# Altium schematic sheet Sheet2.SchDoc
size A4
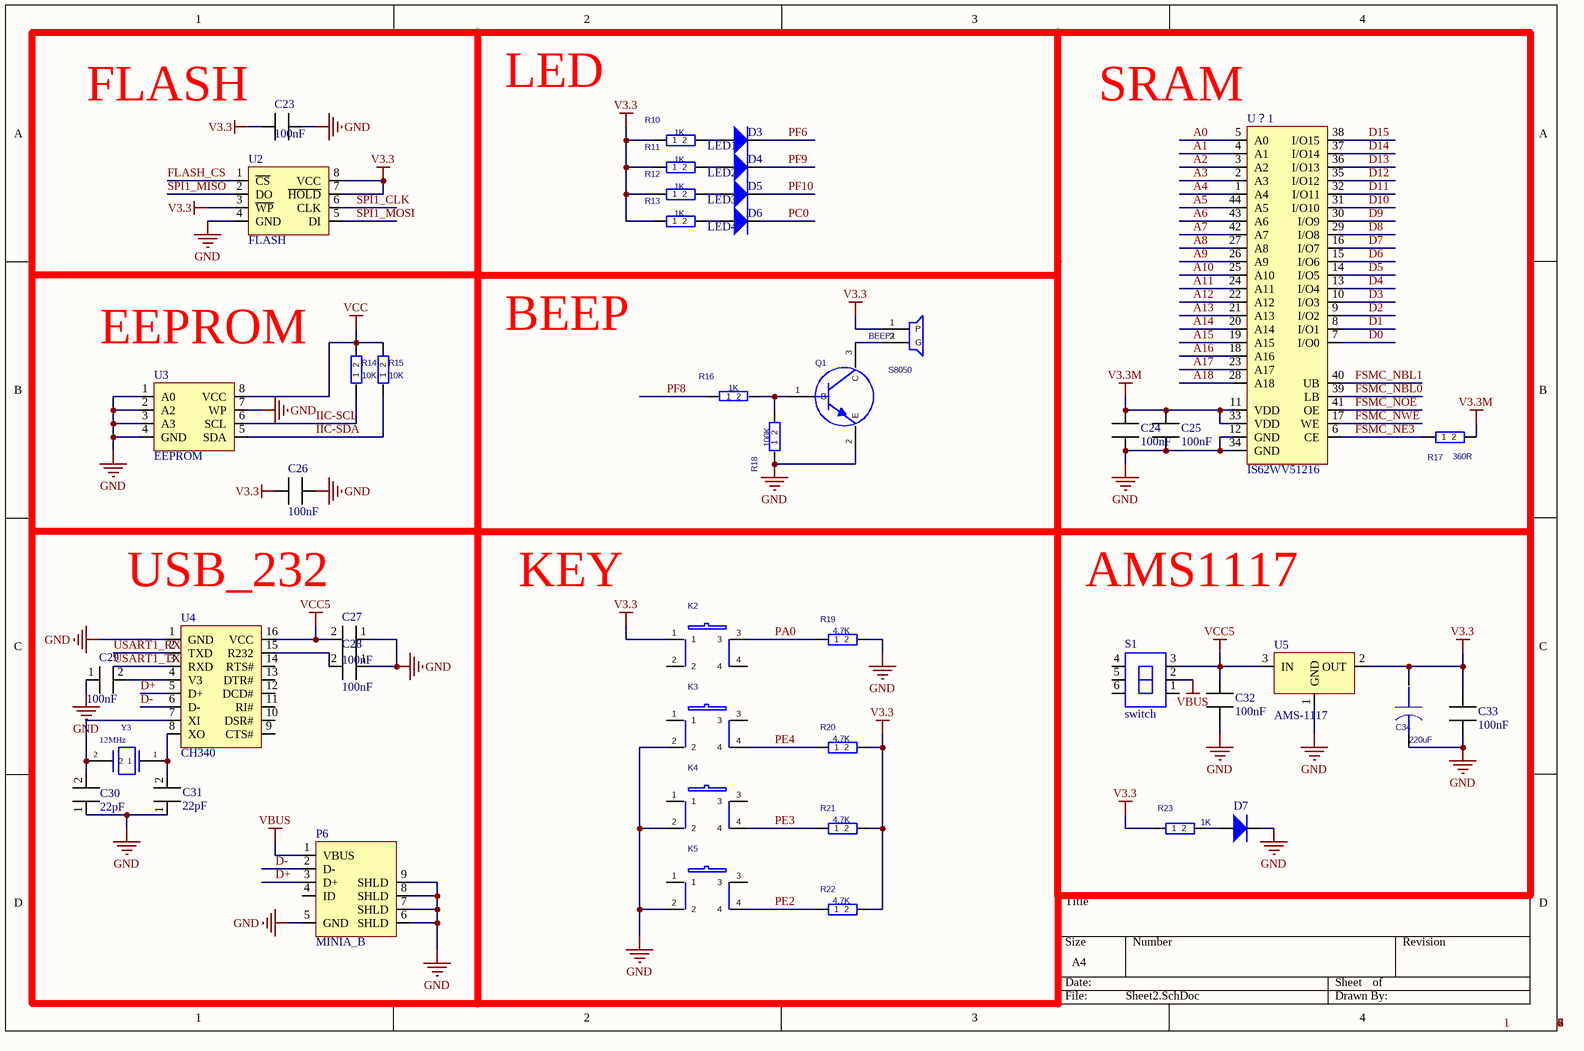
[diagram p0: Sheet2.SchDoc]

## Parts
BEEP1  BEEP-9.5X5.5  [BEEP-9.5X5.5]  (value not drawn)
C23  100nF  [CAP_0603_FIRE]
C24  100nF  [CAP_0603_FIRE]
C25  100nF  [CAP_0603_FIRE]
C26  100nF  [CAP_0603_FIRE]
C27  100nF  [CAP_0603_FIRE]
C28  100nF  [CAP_0603_FIRE]
C29  100nF  [CAP_0603_FIRE]
C30  22pF  [CAP_0603_FIRE]
C31  22pF  [CAP_0603_FIRE]
C32  100nF  [CAP_0603_FIRE]
C33  100nF  [CAP_0603_FIRE]
C34  value 220uF  [CAP+_47UF_FIRE]  (hidden comment: CAP+_47UF_FIRE)
D3  LED1  [DIODE_SOP]
D4  LED2  [DIODE_SOP]
D5  LED3  [DIODE_SOP]
D6  LED4  [DIODE_SOP]
D7  (no value)  [DIODE_SOP]
K2  KEY  [SW6.2/6.2-SMD]  (value not drawn)
K3  KEY  [SW6.2/6.2-SMD]  (value not drawn)
K4  KEY  [SW6.2/6.2-SMD]  (value not drawn)
K5  KEY  [SW6.2/6.2-SMD]  (value not drawn)
P6  MINIA_B  [USB-MINI]
Q1  S8050  [SOT-23]
R10  value 1K  [RES_0603_FIRE]  (hidden comment: RES_1K_0603_FIRE)
R11  value 1K  [RES_0603_FIRE]  (hidden comment: RES_1K_0603_FIRE)
R12  value 1K  [RES_0603_FIRE]  (hidden comment: RES_1K_0603_FIRE)
R13  value 1K  [RES_0603_FIRE]  (hidden comment: RES_1K_0603_FIRE)
R14  value 10K  [RES_0603_FIRE]  (hidden comment: RES_10K_0603_FIRE)
R15  value 10K  [RES_0603_FIRE]  (hidden comment: RES_10K_0603_FIRE)
R16  value 1K  [RES_0603_FIRE]  (hidden comment: RES_100R_0603_FIRE)
R17  value 360R  [RES_0603_FIRE]  (hidden comment: RES_1K_0603_FIRE)
R18  value 100K  [RES_0603_FIRE]  (hidden comment: RES_1K_0603_FIRE)
R19  value 4.7K  [RES_0603_FIRE]  (hidden comment: RES_4K7_0603_FIRE)
R20  value 4.7K  [RES_0603_FIRE]  (hidden comment: RES_4K7_0603_FIRE)
R21  value 4.7K  [RES_0603_FIRE]  (hidden comment: RES_4K7_0603_FIRE)
R22  value 4.7K  [RES_0603_FIRE]  (hidden comment: RES_4K7_0603_FIRE)
R23  value 1K  [RES_0603_FIRE]  (hidden comment: RES_1K_0603_FIRE)
S1  switch  [switch]
U2  FLASH  [SOP8A]
U3  EEPROM  [SOP8]
U4  CH340  [SOP16]
U5  AMS-1117  [AMS-1117-3.3]
U？1  IS62WV51216  [IS62WV51216]
Y3  value 12MHz  [XTAL_SMD]  (hidden comment: XTAL_12M)

## Nets
GND: C23.1 C24.1 C25.1 C26.1 C27.1 C28.1 C29.1 C30.1 C31.1 C32.1 C33.1 C34.2 D7.2 K3.2 K4.2 K5.2 P6.5(GND) P6.6(SHLD) P6.7(SHLD) P6.8(SHLD) P6.9(SHLD) Q1.2(E) R18.1 R19.2 U2.4(GND) U3.1(A0) U3.2(A2) U3.3(A3) U3.4(GND) U3.7(WP) U4.1(GND) U5.1(GND) U？1.12(GND) U？1.34(GND)
V3.3: BEEP1.1(P) C23.2 C26.2 C33.2 C34.1 K2.1 R10.1 R11.1 R12.1 R13.1 R20.2 R21.2 R22.2 R23.1 U2.3(~{WP}) U2.7(~{HOLD}) U2.8(VCC) U5.2(OUT)
V3.3M: C24.2 C25.2 R17.2 U？1.11(VDD) U？1.33(VDD)
VBUS: P6.1(VBUS) S1.2
VCC: R14.2 R15.2 U3.8(VCC)
VCC5: C27.2 C32.2 S1.3 U4.16(VCC) U5.3(IN)
A0: U？1.5(A0)
A1: U？1.4(A1)
A2: U？1.3(A2)
A3: U？1.2(A3)
A4: U？1.1(A4)
A5: U？1.44(A5)
A6: U？1.43(A6)
A7: U？1.42(A7)
A8: U？1.27(A8)
A9: U？1.26(A9)
A10: U？1.25(A10)
A11: U？1.24(A11)
A12: U？1.22(A12)
A13: U？1.21(A13)
A14: U？1.20(A14)
A15: U？1.19(A15)
A16: U？1.18(A16)
A17: U？1.23(A17)
A18: U？1.28(A18)
D0: U？1.7(I/O0)
D1: U？1.8(I/O1)
D2: U？1.9(I/O2)
D3: U？1.10(I/O3)
D4: U？1.13(I/O4)
D5: U？1.14(I/O5)
D6: U？1.15(I/O6)
D7: U？1.16(I/O7)
D8: U？1.29(I/O8)
D9: U？1.30(I/O9)
D10: U？1.31(I/O10)
D11: U？1.32(I/O11)
D12: U？1.35(I/O12)
D13: U？1.36(I/O13)
D14: U？1.37(I/O14)
D15: U？1.38(I/O15)
D+: P6.3(D+) U4.5(D+)
D-: P6.2(D-) U4.6(D-)
FLASH_CS: U2.1(~{CS})
FSMC_NBL0: U？1.39(LB)
FSMC_NBL1: U？1.40(UB)
FSMC_NE3: R17.1 U？1.6(CE)
FSMC_NOE: U？1.41(OE)
FSMC_NWE: U？1.17(WE)
IIC-SCL: R14.1 U3.6(SCL)
IIC-SDA: R15.1 U3.5(SDA)
PA0: K2.3 R19.1
PC0: D6.2
PE2: K5.4 R22.1
PE3: K4.4 R21.1
PE4: K3.4 R20.1
PF6: D3.2
PF8: R16.1
PF9: D4.2
PF10: D5.2
SPI1_CLK: U2.6(CLK)
SPI1_MISO: U2.2(DO)
SPI1_MOSI: U2.5(DI)
USART1_RX: U4.2(TXD)
USART1_TX: U4.3(RXD)
NetBEEP1_2: BEEP1.2(G) Q1.3(C)
NetC28_2: C28.2 U4.15(R232)
NetC29_2: C29.2 U4.4(V3)
NetC30_2: C30.2 U4.7(XI) Y3.2
NetC31_2: C31.2 U4.8(XO) Y3.1
NetD3_1: D3.1 R10.2
NetD4_1: D4.1 R11.2
NetD5_1: D5.1 R12.2
NetD6_1: D6.1 R13.2
NetD7_1: D7.1 R23.2
NetQ1_1: Q1.1(B) R16.2 R18.2

Not connected (* = marked no-connect by the designer): K2 2 4; K3 1 3; K4 1 3; K5 1 3; P6 4(ID); S1 1 4 5 6; U4 9(CTS#) 10(DSR#) 11(RI#) 12(DCD#) 13(DTR#) 14(RTS#)

## Notes on the sheet
- FLASH
- LED
- (near U？1) SRAM
- (near U3) EEPROM
- BEEP
- USB_232
- KEY
- AMS1117
- Labels drawn without touching a wire or pin: 1

## Library data of the parts
C23-C33 = CAP
D3-D7 = LED
Q1 = S8050: NPN; Manufacturer #2: 8050; PCB DECAL: SOT-23
R10-R13 R17 R18 R23 = RES_1K_0603_FIRE: 0402; Manufacture 1: SUPEROHM; Tolerance: +-5%; Assembly: SMD; PCB DECAL: RES_0603_FIRE
R14 R15 = RES_10K_0603_FIRE: SURFACE MOUNT RESISTOR 0.031 X 0.061 INCHES, 1/10W; Assembly: SMD; PCB DECAL: RES_0603_FIRE
R16 = RES_100R_0603_FIRE: 0402; Manufacture 1: SUPEROHM; Tolerance: +-5%; Assembly: SMD; PCB DECAL: RES_0603_FIRE
R19-R22 = RES_4K7_0603_FIRE: 0402; Manufacture 1: SUPEROHM; Tolerance: +-5%; PCB DECAL: RES_0603_FIRE
BEEP1 = BEEP-9.5X5.5: PCB DECAL: BEEP-9.5X5.5
C34 = CAP+_47UF_FIRE: PCB DECAL: CAP+_47UF_FIRE
K2-K5 = KEY: Manufacturer #1 PN: KEY; PCB DECAL: SW6.2/6.2-SMD
Y3 = XTAL_12M: PCB DECAL: XTAL_SMD